# Altium project MCU20.PrjPcb
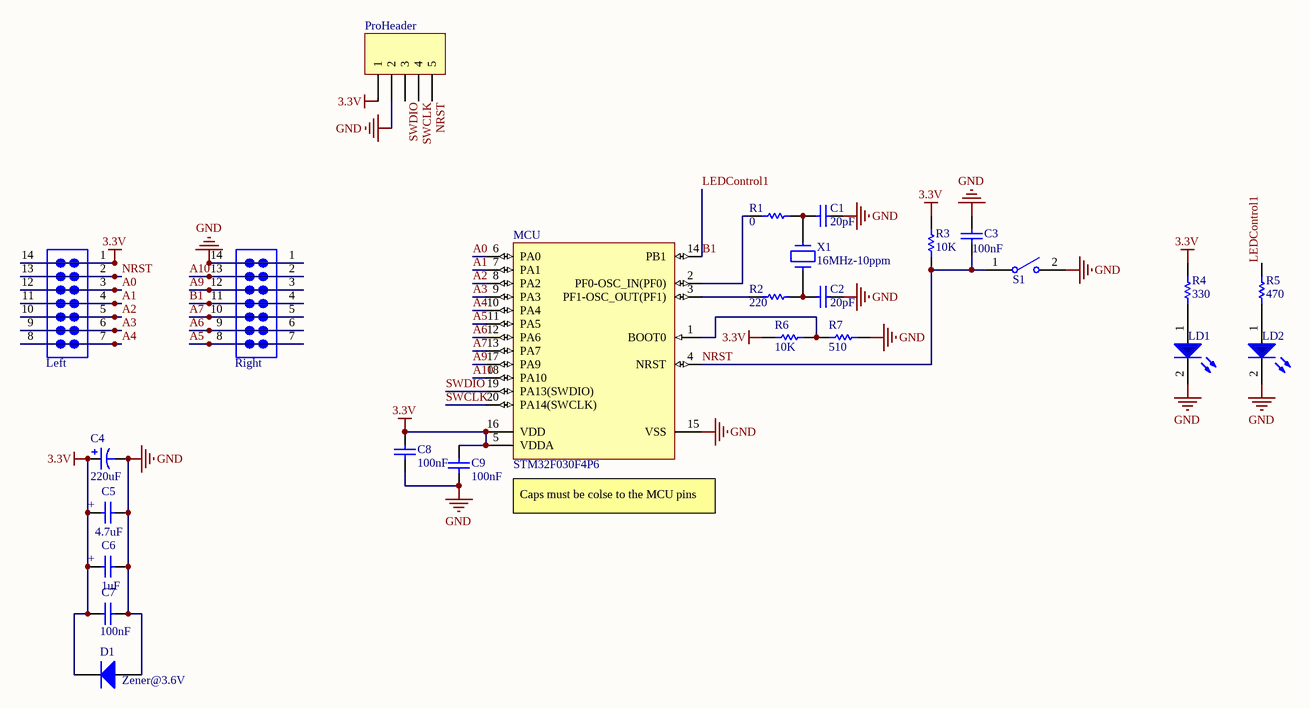
[diagram p0: MCU20.SchDoc]
1 sheet, 25 parts. Net scope: global (net labels, ports and power ports of the same name join across sheets).
Board file: MCU20.PcbDoc

## Sheet MCU20.SchDoc
size A4

### Parts
C1  20pF  [SMD 805 CAP]
C2  20pF  [SMD 805 CAP]
C3  100nF  [SMD 805 CAP]
C4  220uF  [Cap D]
C5  4.7uF  [MY_CAP_SMD-A]
C6  1uF  [MY_CAP_SMD-A]
C7  100nF  [SMD 805 CAP]
C8  100nF  [SMD 805 CAP]
C9  100nF  [SMD 805 CAP]
D1  Zener@3.6V  [MiniMelf]
LD1  150080BS75000  [LED_0805_Blue]  (value not drawn)
LD2  150080BS75000  [LED_0805_Blue]  (value not drawn)
Left  WE-2.54 mm Pin Header & Jumper 61301421121  [61301421121]  (value not drawn)
MCU  STM32F030F4P6  [STM-TSSOP20_L]
ProHeader  WE-2.54 mm Pin Header & Jumper 61300511021  [61300511021]  (value not drawn)
R1  0  [SMD 805]
R2  220  [SMD 805]
R3  10K  [SMD 805]
R4  330  [SMD 805]
R5  470  [SMD 805]
R6  10K  [SMD 805]
R7  510  [SMD 805]
Right  WE-2.54 mm Pin Header & Jumper 61301421121  [61301421121]  (value not drawn)
S1  Tact Switch  [4341x10438x6]  (value not drawn)
X1  16MHz-10ppm  [My_Crystal]

### Nets
3.3V: C4.1 C5.+ C6.+ C7.1 C8.1 C9.1 D1.2 Left.1 Left.14 MCU.5(VDDA) MCU.16(VDD) ProHeader.1 R3.2 R4.2 R6.2
GND: C1.1 C2.2 C3.2 C4.2 C5.- C6.- C7.2 C8.2 C9.2 D1.1 LD1.2(C) LD2.2(C) MCU.15(VSS) ProHeader.2 R7.1 Right.1 Right.14 S1.2
A0: Left.3 Left.12 MCU.6(PA0)
A1: Left.4 Left.11 MCU.7(PA1)
A2: Left.5 Left.10 MCU.8(PA2)
A3: Left.6 Left.9 MCU.9(PA3)
A4: Left.7 Left.8 MCU.10(PA4)
A5: MCU.11(PA5) Right.7 Right.8
A6: MCU.12(PA6) Right.6 Right.9
A7: MCU.13(PA7) Right.5 Right.10
A9: MCU.17(PA9) Right.3 Right.12
A10: MCU.18(PA10) Right.2 Right.13
B1: MCU.14(PB1) R5.2 Right.4 Right.11  [also labelled LEDControl1]
NRST: C3.1 Left.2 Left.13 MCU.4(NRST) ProHeader.5 R3.1 S1.1
SWCLK: MCU.20(PA14(SWCLK)) ProHeader.4
SWDIO: MCU.19(PA13(SWDIO)) ProHeader.3
NetC1_2: C1.2 R1.2 X1.2
NetC2_1: C2.1 R2.2 X1.1
NetLD1_1: LD1.1(A) R4.1
NetLD2_1: LD2.1(A) R5.1
NetMCU_1: MCU.1(BOOT0) R6.1 R7.2
NetMCU_2: MCU.2(PF0-OSC_IN(PF0)) R1.1
NetMCU_3: MCU.3(PF1-OSC_OUT(PF1)) R2.1

### Notes on the sheet
- Caps must be colse to the MCU pins

### Library data of the parts
C1-C3 C7-C9 = CAP without Pole
C4 = CAP
C5 C6 = CAP_TANTAL_A: 3.2X1.6MM; Value: 3300u
D1 = Diode 1N4007
LD1 LD2 = WL-SMCW 0805  150080BS75000: SMD mono-color Chip LED, WL-SMCW, Blue; Manufacturer: W黵th Elektronik eiSos GmbH; PartNo: 150080BS75000; ComponentLink1Description: Manufacturer; ComponentLink1URL: http://www.we-online.de; Created by: Christin Otto; Created Date: June 2013; ComponentLink2Description: Datasheet; ComponentLink2URL: http://katalog.we-online.com/led/datasheet/150080BS75000.pdf; Color: Blue
Left Right = WE-2.54 mm Pin Header & Jumper 61301421121: WR-PHD 2.54 mm Dual Pin Header; Manufacturer: W¨¹rth Elektronik eiSos GmbH; ComponentLink1 Description: Manufacturer; ComponentLink2 Description: Datasheet; NoPins: 14; Created Date: 25 March 2013; partNo: 61301421121; ComponentLink1URL: http://www.we-online.com; ComponentLink2URL: http://katalog.we-online.de/em/datasheet/6130xx21121.pdf; Created by: Karrer Zheng
MCU = STM32F030F4P6: ARM Cortex-M0 32-bit MCU, 16 KB Flash, 4 KB Internal RAM, 15 I/Os, 20-pin TSSOP, -40 to 85 degC, Tube; FLASH Size (Prog) (kB): 16; I/Os (High Current): 15; Internal RAM Size (kB): 4; Operating Frequency(F) (Processor speed) (MHz): 48; Supply Voltage(Vcc) min (V): 2.4; DatasheetVersion: Rev. 1; PackageVersion: Rev. 1, 11/2012; PackageReference: TSSOP20; PackageDescription: 20-Pin Thin Shrink Small Outline Package, 6.5 x 4.4 mm Body, 0.65 mm Pitch; Supplier 1: Digi-Key; Supplier Part Number 1: 497-14044-5-ND; Supplier 2: Newark; Supplier Part Number 2: 06X3648; Supplier 3: Mouser; Supplier Part Number 3: 511-STM32F030F4P6; Core: ARM Cortex-M0; Packing: Tube; Mounting Technology: Surface Mount; PartNumber: STM32F030F4P6; ComponentLink1Description: Manufacturer URL; ComponentLink1URL: http://www.st.com/web/en/home.html; ComponentLink2Description: Datasheet; ComponentLink2URL: http://www.st.com/st-web-ui/static/active/en/resource/technical/document/datasheet/DM00088500.pdf; ComponentLink3Description: Package Specification; ComponentLink3URL: http://www.st.com/st-web-ui/static/active/en/resource/technical/document/datasheet/DM00065136.pdf
ProHeader = WE-2.54 mm Pin Header & Jumper 61300511021: WR-PHD 2.54mm Angled Pin Header; Manufacturer: W¨¹rth Elektronik eiSos GmbH; ComponentLink1 Description: Manufacturer; ComponentLink2 Description: Datasheet; NoPins: 05; Created Date: 25 March 2013; partNo: 61300511021; ComponentLink1URL: http://www.we-online.com; ComponentLink2URL: http://katalog.we-online.de/em/datasheet/6130xx11021.pdf; Created by: Karrer Zheng
R1-R7 = Resistor
S1 = WS-TASV, 434111043826: WS-TASV 6.0x3.5 mm SMD; Manufacturer: Wurth Elektronik; partNo: 434111043826; ComponentLink1Description: Manufacturer; ComponentLink1URL: http://www.we-online.de; Created by: Baojun Chen; Created Date: Dec.2015; ComponentLink2Description: Datasheet; ComponentLink2URL: http://katalog.we-online.de/em/datasheet/4341x1xxx8x6.pdf
X1 = CRYSTAL